# Altium schematic sheet USBHUB.SchDoc: USBHUB
size A4; Author: SchumyHao; DocumentNumber: 6; Revision: V01; SheetNumber: 6; SheetTotal: 7
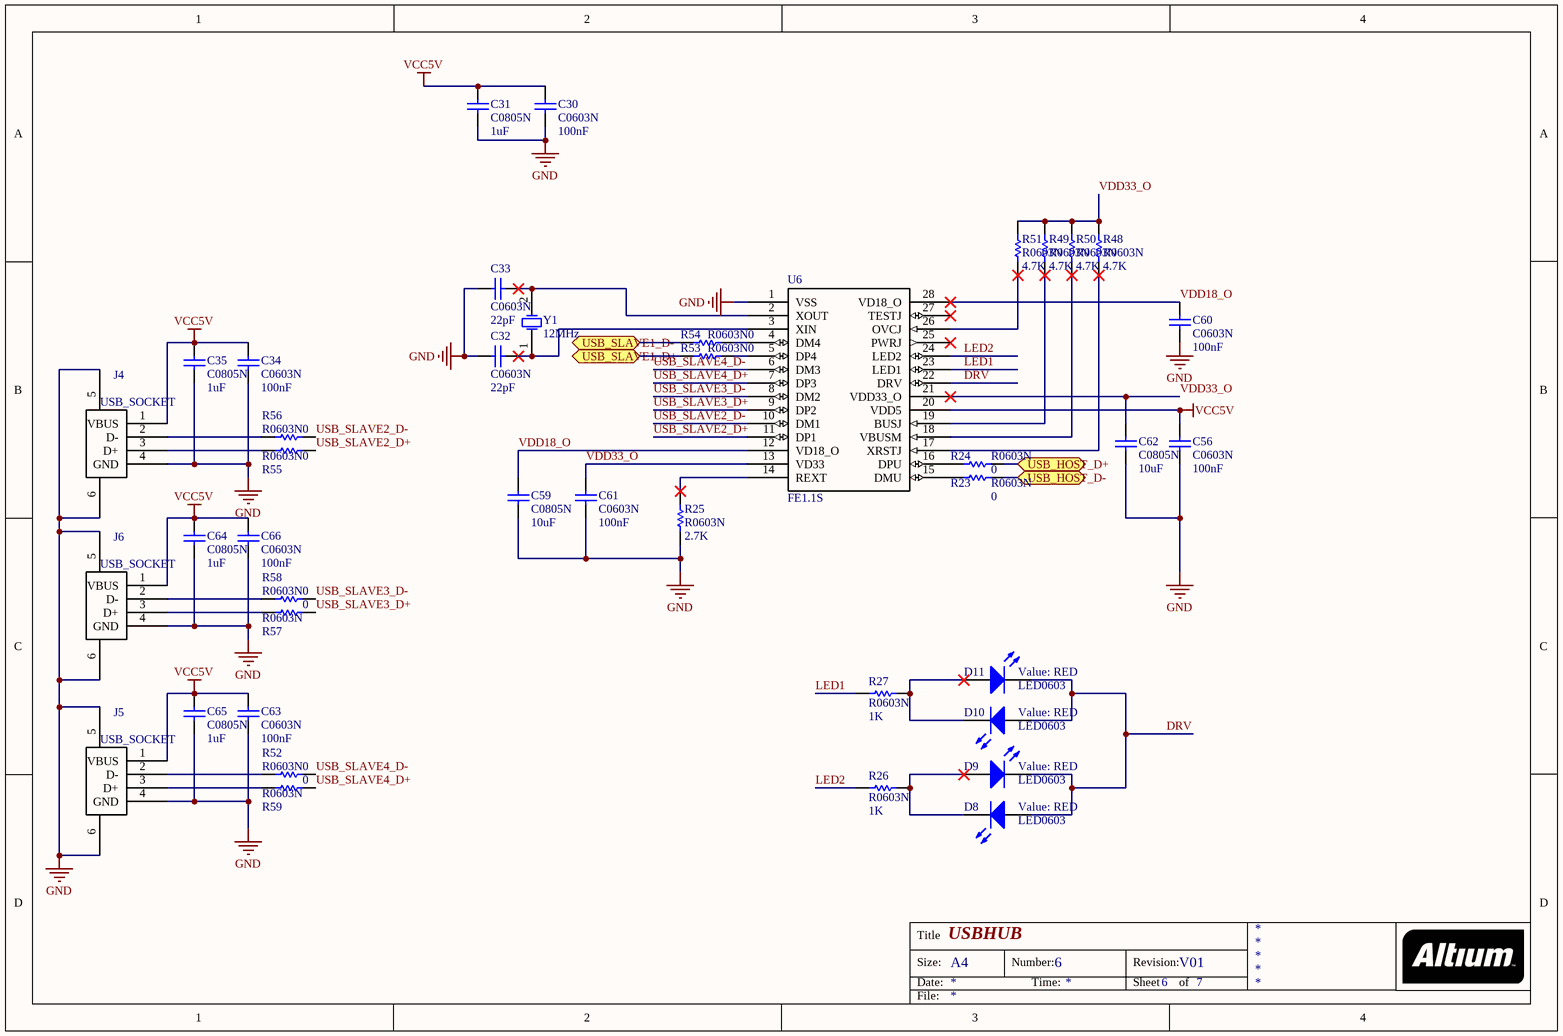
[diagram p0: USBHUB.SchDoc]

## Parts
C30  C0603N  value 100nF  [C0603N]
C31  C0805N  value 1uF  [C0805N]
C32  C0603N  value 22pF  [C0603N]
C33  C0603N  value 22pF  [C0603N]
C34  C0603N  value 100nF  [C0603N]
C35  C0805N  value 1uF  [C0805N]
C56  C0603N  value 100nF  [C0603N]
C59  C0805N  value 10uF  [C0805N]
C60  C0603N  value 100nF  [C0603N]
C61  C0603N  value 100nF  [C0603N]
C62  C0805N  value 10uF  [C0805N]
C63  C0603N  value 100nF  [C0603N]
C64  C0805N  value 1uF  [C0805N]
C65  C0805N  value 1uF  [C0805N]
C66  C0603N  value 100nF  [C0603N]
D8  LED0603  value RED  [LED0603]
D9  LED0603  value RED  [LED0603]
D10  LED0603  value RED  [LED0603]
D11  LED0603  value RED  [LED0603]
J4  USB_SOCKET  [USB-A-90-L]
J5  USB_SOCKET  [USB-A-90-L]
J6  USB_SOCKET  [USB-A-90-L]
R23  R0603N  value 0  [R0603N]
R24  R0603N  value 0  [R0603N]
R25  R0603N  value 2.7K  [R0603N]
R26  R0603N  value 1K  [R0603N]
R27  R0603N  value 1K  [R0603N]
R48  R0603N  value 4.7K  [R0603N]
R49  R0603N  value 4.7K  [R0603N]
R50  R0603N  value 4.7K  [R0603N]
R51  R0603N  value 4.7K  [R0603N]
R52  R0603N  value 0  [R0603N]
R53  R0603N  value 0  [R0603N]
R54  R0603N  value 0  [R0603N]
R55  R0603N  value 0  [R0603N]
R56  R0603N  value 0  [R0603N]
R57  R0603N  value 0  [R0603N]
R58  R0603N  value 0  [R0603N]
R59  R0603N  value 0  [R0603N]
U6  FE1.1S  [SSOP28]
Y1  12MHz  [XTAL_5032_2]

## Ports
USB_HOST_D+ (bidir), USB_HOST_D- (bidir), USB_SLAVE1_D+ (bidir), USB_SLAVE1_D- (bidir)

## Nets
GND: C30.1 C31.1 C32.2 C33.2 C34.1 C35.1 C56.1 C59.2 C60.1 C61.2 C62.1 C63.1 C64.1 C65.1 C66.1 J4.4(GND) J4.5 J4.6 J5.4(GND) J5.5 J5.6 J6.4(GND) J6.5 J6.6 R25.1 U6.1(VSS)
VCC5V: C30.2 C31.2 C34.2 C35.2 C56.2 C63.2 C64.2 C65.2 C66.2 J4.1(VBUS) J5.1(VBUS) J6.1(VBUS) U6.20(VDD5)
DRV: D8.1(A) D9.2(K) D10.1(A) D11.2(K) U6.22(DRV)
LED1: R27.2 U6.23(LED1)
LED2: R26.2 U6.24(LED2)
USB_HOST_D+: R24.2 ; port USB_HOST_D+
USB_HOST_D-: R23.2 ; port USB_HOST_D-
USB_SLAVE1_D+: R53.1 ; port USB_SLAVE1_D+
USB_SLAVE1_D-: R54.1 ; port USB_SLAVE1_D-
USB_SLAVE2_D+: R55.2 U6.11(DP1)
USB_SLAVE2_D-: R56.2 U6.10(DM1)
USB_SLAVE3_D+: R57.2 U6.9(DP2)
USB_SLAVE3_D-: R58.2 U6.8(DM2)
USB_SLAVE4_D+: R59.2 U6.7(DP3)
USB_SLAVE4_D-: R52.2 U6.6(DM3)
VDD18_O: C59.1 C60.2 U6.12(VD18_O) U6.28(VD18_O)
VDD33_O: C61.1 C62.2 R48.2 R49.2 R50.2 R51.2 U6.13(VD33) U6.21(VDD33_O)
NetC32_1: C32.1 U6.3(XIN) Y1.1(OSC1)
NetC33_1: C33.1 U6.2(XOUT) Y1.2(OSC2)
NetD8_2: D8.2(K) D9.1(A) R26.1
NetD10_2: D10.2(K) D11.1(A) R27.1
NetJ4_2: J4.2(D-) R56.1
NetJ4_3: J4.3(D+) R55.1
NetJ5_2: J5.2(D-) R52.1
NetJ5_3: J5.3(D+) R59.1
NetJ6_2: J6.2(D-) R58.1
NetJ6_3: J6.3(D+) R57.1
NetR23_1: R23.1 U6.15(DMU)
NetR24_1: R24.1 U6.16(DPU)
NetR25_2: R25.2 U6.14(REXT)
NetR48_1: R48.1 U6.17(XRSTJ)
NetR49_1: R49.1 U6.19(BUSJ)
NetR50_1: R50.1 U6.18(VBUSM)
NetR51_1: R51.1 U6.26(OVCJ)
NetR53_2: R53.2 U6.5(DP4)
NetR54_2: R54.2 U6.4(DM4)

Not connected (* = marked no-connect by the designer): U6 25(PWRJ)* 27(TESTJ)*

## Notes on the sheet
- Title
- Size:
- Date:
- A4
- Number:
- Time:
- Revision:
- Sheet
- of
- File:

## Library data of the parts
C30-C35 C56 C59-C66 = Cap Semi: Capacitor (Semiconductor SIM Model)
D8-D11 = LED
J4-J6 = USB_SOCKET: USB_TYPEA_SOCKET
R23-R27 R48-R59 = Res Semi: Semiconductor Resistor
Y1 = XTAL: Crystal Oscillator